# Altium schematic sheet POWR0008_BCR_System.SchDoc: BLUEsat solar battery charge regulator subystem
size A3; Engineer: Thomas Fisk; Organization: BLUEsat Project; Address1: Room 419; Address2: School of EE&T; Address3: UNSW, NSW 2052; Address4: Australia; DocumentNumber: POWR0008; SheetNumber: 1; SheetTotal: 1; Description: Solar battery charge regulator subsystem.; Version: 2.6; PageSetup: Record=PageOptions|CenterHorizontal=True|CenterVertical=True|PrintScale=0.71|XCorrection=1.00|YCorrection=1.00|PrintKind=1|BorderSize=5000000|LeftOffset=0|BottomOffset=0|Orientation=2|PaperLength=2970|PaperWidth=2100|Scale=100|PaperSource=7|PrintQuality=1200|MediaType=1|DitherType=10|PaperKind=A4|PrintScaleMode=1
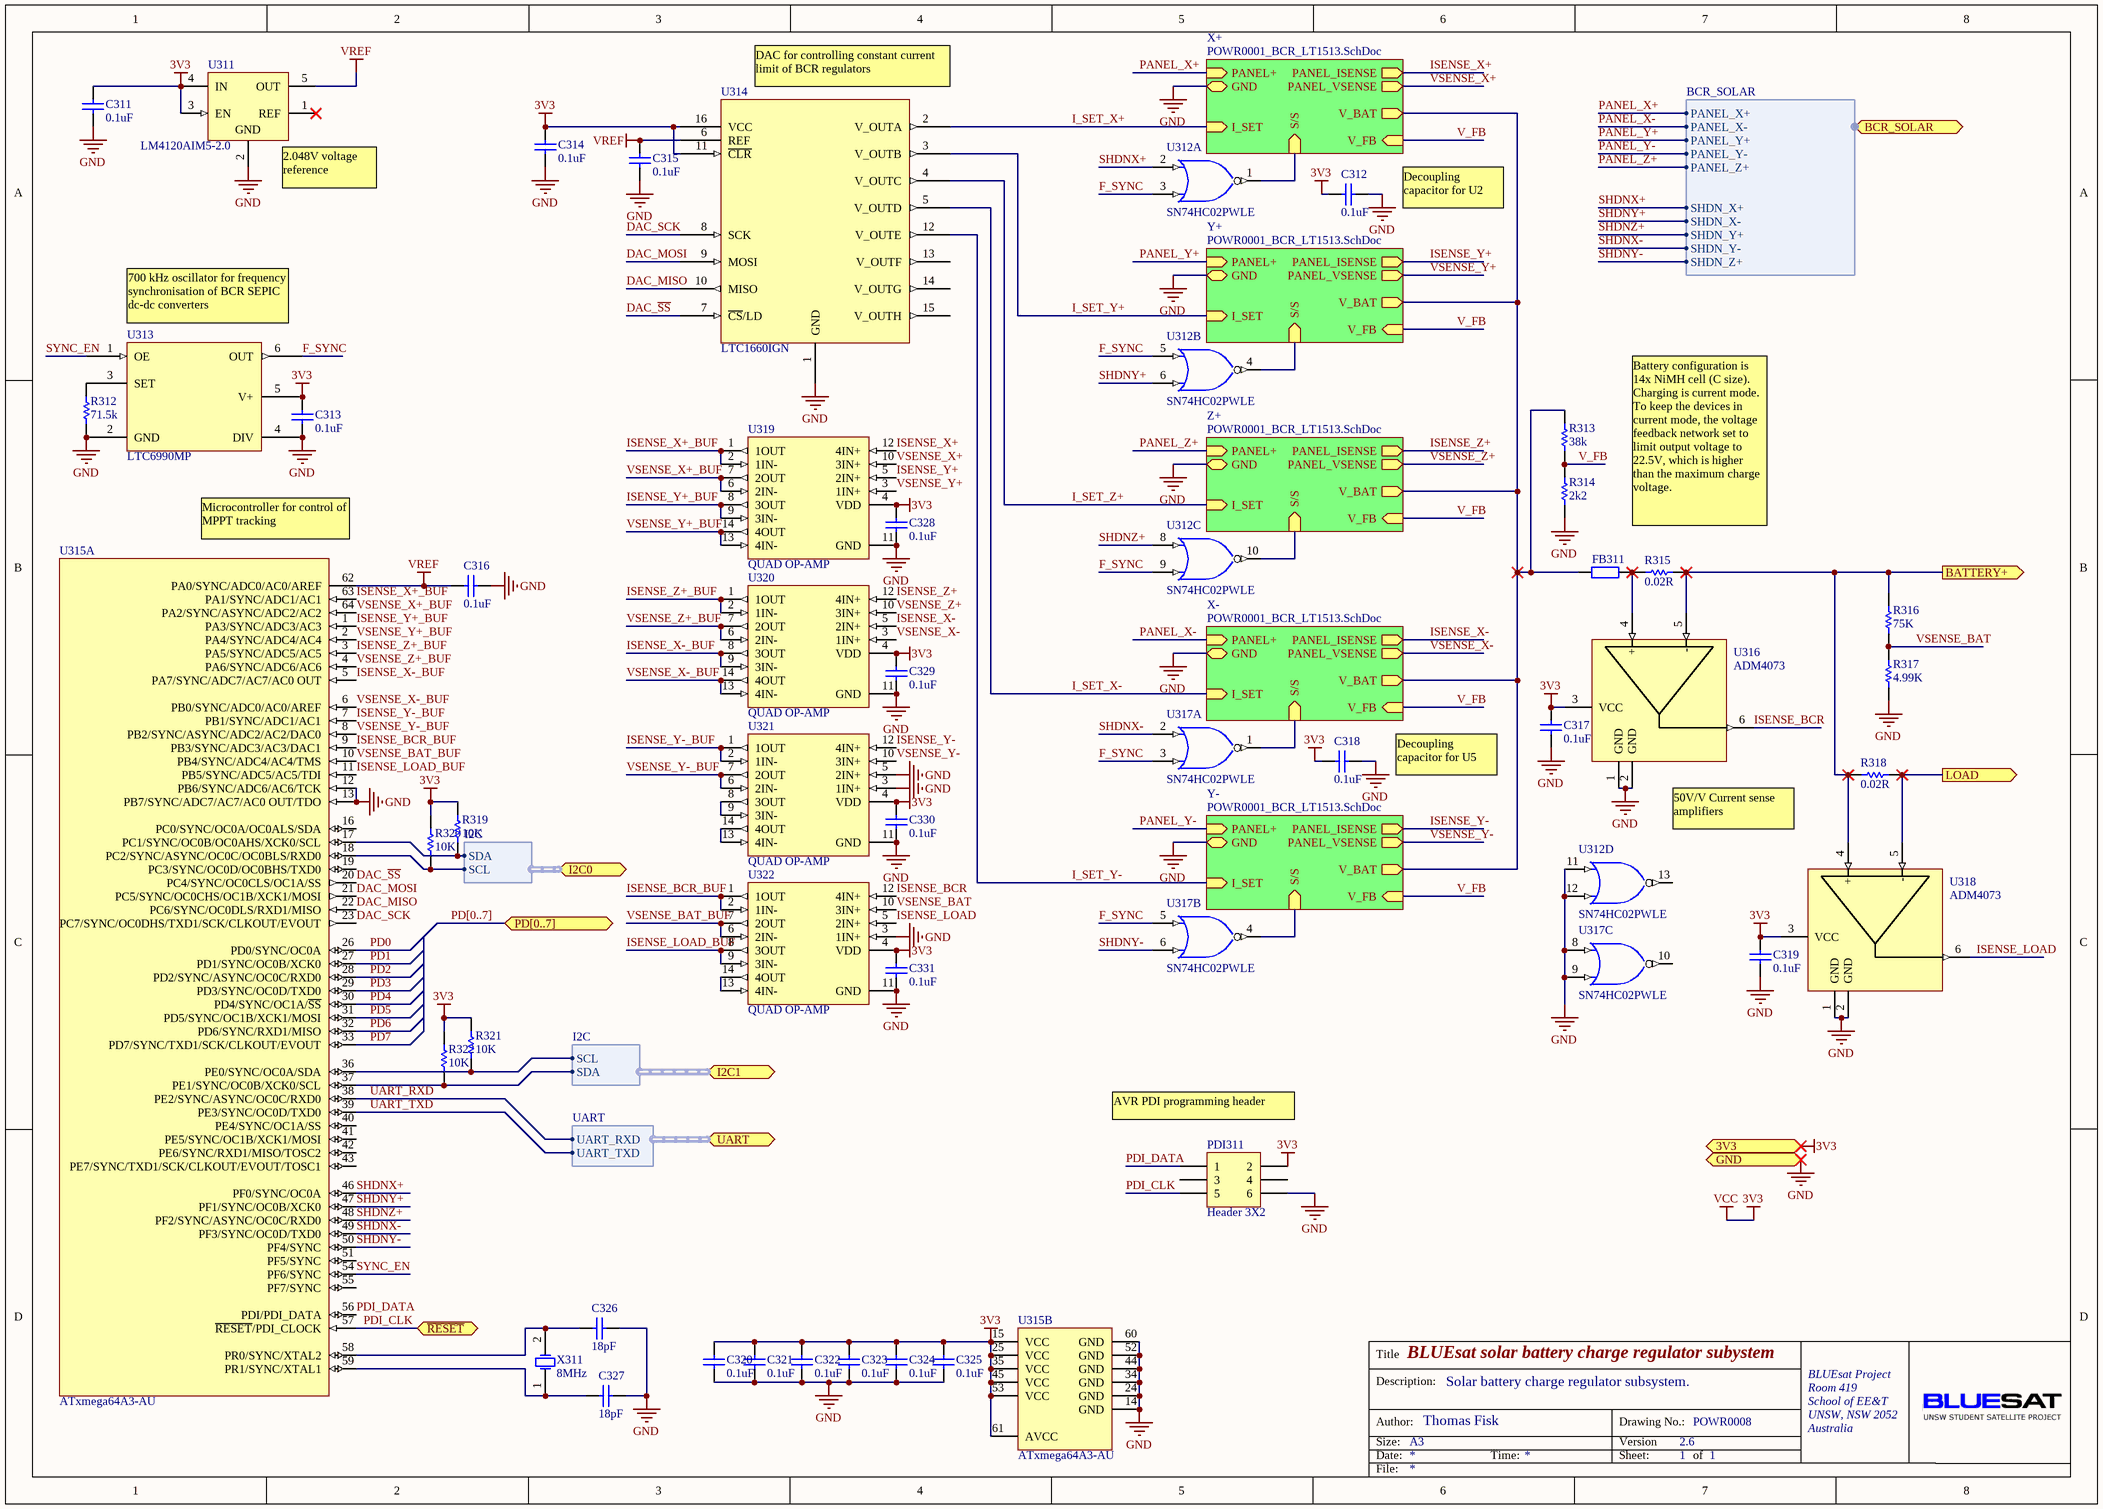
[diagram p0: POWR0008_BCR_System.SchDoc]

## Parts
C311  value 0.1uF  [CAPC2012M]  (hidden comment: Cap)
C312  value 0.1uF  [CAPC2012M]  (hidden comment: Cap)
C313  value 0.1uF  [CAPC2012M]  (hidden comment: Cap)
C314  value 0.1uF  [CAPC2012M]  (hidden comment: Cap)
C315  value 0.1uF  [CAPC2012M]  (hidden comment: Cap)
C316  value 0.1uF  [CAPC2012M]  (hidden comment: Cap)
C317  value 0.1uF  [CAPC2012M]  (hidden comment: Cap)
C318  value 0.1uF  [CAPC2012M]  (hidden comment: Cap)
C319  value 0.1uF  [CAPC2012M]  (hidden comment: Cap)
C320  value 0.1uF  [CAPC2012M]  (hidden comment: Cap)
C321  value 0.1uF  [CAPC2012M]  (hidden comment: Cap)
C322  value 0.1uF  [CAPC2012M]  (hidden comment: Cap)
C323  value 0.1uF  [CAPC2012M]  (hidden comment: Cap)
C324  value 0.1uF  [CAPC2012M]  (hidden comment: Cap)
C325  value 0.1uF  [CAPC2012M]  (hidden comment: Cap)
C326  value 18pF  [CAPC2012M]  (hidden comment: Cap)
C327  value 18pF  [CAPC2012M]  (hidden comment: Cap)
C328  value 0.1uF  [CAPC2012M]  (hidden comment: Cap)
C329  value 0.1uF  [CAPC2012M]  (hidden comment: Cap)
C330  value 0.1uF  [CAPC2012M]  (hidden comment: Cap)
C331  value 0.1uF  [CAPC2012M]  (hidden comment: Cap)
FB311  Res2  [RESC2012M]  (value not drawn)
PDI311  Header 3X2  [HDR2X3]
R312  value 71.5k  [RESC2012M]  (hidden comment: Res1)
R313  value 38k  [RESC2012M]  (hidden comment: Res1)
R314  value 2k2  [RESC2012M]  (hidden comment: Res1)
R315  value 0.02R  [RESC2012M]  (hidden comment: 0805 Resistor)
R316  value 75K  [RESC2012M]  (hidden comment: Res1)
R317  value 4.99K  [RESC2012M]  (hidden comment: Res1)
R318  value 0.02R  [RESC2012M]  (hidden comment: 0805 Resistor)
R319  value 10K  [RESC2012M]  (hidden comment: Res1)
R320  value 10K  [RESC2012M]  (hidden comment: Res1)
R321  value 10K  [RESC2012M]  (hidden comment: Res1)
R322  value 10K  [RESC2012M]  (hidden comment: Res1)
U311  LM4120AIM5-2.0  [MF05A_N]
U312  SN74HC02PWLE  [TSOP65P640-14AN]  (parts A,B,C,D of 4)
U313  LTC6990MP  [SOT26A-6L]
U314  LTC1660IGN  [SOP635P600-16N]
U315  ATxmega64A3-AU  [64A_N]  (parts A,B of 2)
U316  ADM4073  [SOT26A-6N]
U317  SN74HC02PWLE  [TSOP65P640-14AN]  (parts A,B,C of 4)
U318  ADM4073  [SOT26A-6N]
U319  QUAD OP-AMP  [TSOP65P640-14AN]
U320  QUAD OP-AMP  [TSOP65P640-14AN]
U321  QUAD OP-AMP  [TSOP65P640-14AN]
U322  QUAD OP-AMP  [TSOP65P640-14AN]
X311  8MHz  [HC49 - No border]

## Sub-sheets
X+ = POWR0001_BCR_LT1513.SchDoc: I_SET (in), V_BAT, S/S (in), V_FB (in), PANEL_VSENSE (out), PANEL_ISENSE (out), PANEL+ (in), GND
X- = POWR0001_BCR_LT1513.SchDoc: I_SET (in), V_BAT, S/S (in), V_FB (in), PANEL_VSENSE (out), PANEL_ISENSE (out), PANEL+ (in), GND
Y+ = POWR0001_BCR_LT1513.SchDoc: I_SET (in), V_BAT, S/S (in), V_FB (in), PANEL_VSENSE (out), PANEL_ISENSE (out), PANEL+ (in), GND
Y- = POWR0001_BCR_LT1513.SchDoc: I_SET (in), V_BAT, S/S (in), V_FB (in), PANEL_VSENSE (out), PANEL_ISENSE (out), PANEL+ (in), GND
Z+ = POWR0001_BCR_LT1513.SchDoc: I_SET (in), V_BAT, S/S (in), V_FB (in), PANEL_VSENSE (out), PANEL_ISENSE (out), PANEL+ (in), GND

## Ports
3V3, BATTERY+ (out), BCR_SOLAR (harness BCR_SOLAR), GND, I2C0 (harness I2C), I2C1 (harness I2C), LOAD (out), PD[0..7] (bidir), UART (harness UART), ~{RESET} (bidir)

## Harnesses
BCR_SOLAR: PANEL_X+, PANEL_X-, PANEL_Y+, PANEL_Y-, PANEL_Z+, SHDN_X+, SHDN_X-, SHDN_Y+, SHDN_Y-, SHDN_Z+
I2C: SCL, SDA
UART: UART_TXD, UART_RXD

## Nets
3V3: C311.2 C312.2 C313.1 C314.2 C317.1 C318.2 C319.1 C320.2 C321.2 C322.2 C323.2 C324.2 C325.2 C328.1 C329.1 C330.1 C331.1 PDI311.2 R319.1 R320.1 R321.1 R322.1 U311.3(EN) U311.4(IN) U312.14(VCC) U313.5(V+) U314.11(~{CLR}) U314.16(VCC) U315.15(VCC) U315.25(VCC) U315.35(VCC) U315.45(VCC) U315.53(VCC) U315.61(AVCC) U316.3(VCC) U317.14(VCC) U318.3(VCC) U319.4(VDD) U320.4(VDD) U321.4(VDD) U322.4(VDD) ; port 3V3  [also labelled VCC]
GND: C311.1 C312.1 C313.2 C314.1 C315.1 C316.1 C317.2 C318.1 C319.2 C320.1 C321.1 C322.1 C323.1 C324.1 C325.1 C326.2 C327.1 C328.2 C329.2 C330.2 C331.2 PDI311.6 R312.1 R314.1 R317.2 U311.2(GND) U312.7(GND) U312.11(A) U312.12(B) U313.2(GND) U313.4(DIV) U314.1(GND) U315.12(PB6/SYNC/ADC6/AC6/TCK) U315.13(PB7/SYNC/ADC7/AC7/AC0_OUT/TDO) U315.14(GND) U315.24(GND) U315.34(GND) U315.44(GND) U315.52(GND) U315.60(GND) U316.1(GND) U316.2(GND) U317.7(GND) U317.8(A) U317.9(B) U318.1(GND) U318.2(GND) U319.11(GND) U320.11(GND) U321.3(1IN+) U321.5(2IN+) U321.11(GND) U322.3(1IN+) U322.11(GND) ; port GND, sheet X+/GND, sheet Y+/GND, sheet Z+/GND, sheet X-/GND, sheet Y-/GND
VREF: C315.2 C316.2 U311.5(OUT) U314.6(REF) U315.62(PA0/SYNC/ADC0/AC0/AREF)
BATTERY+: R315.2 R316.1 R318.2 U316.5(-) U318.4(+) ; port BATTERY+
DAC_MISO: U314.10(MISO) U315.22(PC6/SYNC/OC0DLS/RXD1/MISO)
DAC_MOSI: U314.9(MOSI) U315.21(PC5/SYNC/OC0CHS/OC1B/XCK1/MOSI)
DAC_~{SS}: U314.7(~{CS}/LD) U315.20(PC4/SYNC/OC0CLS/OC1A/SS)
DAC_SCK: U314.8(SCK) U315.23(PC7/SYNC/OC0DHS/TXD1/SCK/CLKOUT/EVOUT)
F_SYNC: U312.3(B) U312.5(A) U312.9(B) U313.6(OUT) U317.3(B) U317.5(A)
I_SET_X+: U314.2(V_OUTA) ; sheet X+/I_SET
I_SET_X-: U314.5(V_OUTD) ; sheet X-/I_SET
I_SET_Y+: U314.3(V_OUTB) ; sheet Y+/I_SET
I_SET_Y-: U314.12(V_OUTE) ; sheet Y-/I_SET
I_SET_Z+: U314.4(V_OUTC) ; sheet Z+/I_SET
ISENSE_BCR: U316.6 U322.12(4IN+)
ISENSE_BCR_BUF: U315.9(PB3/SYNC/ADC3/AC3/DAC1) U322.1(1OUT) U322.2(1IN-)
ISENSE_LOAD: U318.6 U322.5(2IN+)
ISENSE_LOAD_BUF: U315.11(PB5/SYNC/ADC5/AC5/TDI) U322.8(3OUT) U322.9(3IN-)
ISENSE_X+: U319.12(4IN+) ; sheet X+/PANEL_ISENSE
ISENSE_X+_BUF: U315.63(PA1/SYNC/ADC1/AC1) U319.1(1OUT) U319.2(1IN-)
ISENSE_X-: U320.5(2IN+) ; sheet X-/PANEL_ISENSE
ISENSE_X-_BUF: U315.5(PA7/SYNC/ADC7/AC7/AC0_OUT) U320.8(3OUT) U320.9(3IN-)
ISENSE_Y+: U319.5(2IN+) ; sheet Y+/PANEL_ISENSE
ISENSE_Y+_BUF: U315.1(PA3/SYNC/ADC3/AC3) U319.8(3OUT) U319.9(3IN-)
ISENSE_Y-: U321.12(4IN+) ; sheet Y-/PANEL_ISENSE
ISENSE_Y-_BUF: U315.7(PB1/SYNC/ADC1/AC1) U321.1(1OUT) U321.2(1IN-)
ISENSE_Z+: U320.12(4IN+) ; sheet Z+/PANEL_ISENSE
ISENSE_Z+_BUF: U315.3(PA5/SYNC/ADC5/AC5) U320.1(1OUT) U320.2(1IN-)
LOAD: R318.1 U318.5(-) ; port LOAD
PANEL_X+: sheet X+/PANEL+, port BCR_SOLAR.PANEL_X+
PANEL_X-: sheet X-/PANEL+, port BCR_SOLAR.PANEL_X-
PANEL_Y+: sheet Y+/PANEL+, port BCR_SOLAR.PANEL_Y+
PANEL_Y-: sheet Y-/PANEL+, port BCR_SOLAR.PANEL_Y-
PANEL_Z+: sheet Z+/PANEL+, port BCR_SOLAR.PANEL_Z+
PD0: U315.26(PD0/SYNC/OC0A)
PD1: U315.27(PD1/SYNC/OC0B/XCK0)
PD2: U315.28(PD2/SYNC/ASYNC/OC0C/RXD0)
PD3: U315.29(PD3/SYNC/OC0D/TXD0)
PD4: U315.30(PD4/SYNC/OC1A/~{SS})
PD5: U315.31(PD5/SYNC/OC1B/XCK1/MOSI)
PD6: U315.32(PD6/SYNC/RXD1/MISO)
PD7: U315.33(PD7/SYNC/TXD1/SCK/CLKOUT/EVOUT)
PDI_CLK: PDI311.5 U315.57(~{RESET}/PDI_CLOCK) ; port ~{RESET}
PDI_DATA: PDI311.1 U315.56(PDI/PDI_DATA)
SHDNX+: U312.2(A) U315.46(PF0/SYNC/OC0A) ; port BCR_SOLAR.SHDN_X+
SHDNX-: U315.49(PF3/SYNC/OC0D/TXD0) U317.2(A) ; port BCR_SOLAR.SHDN_Y-
SHDNY+: U312.6(B) U315.47(PF1/SYNC/OC0B/XCK0) ; port BCR_SOLAR.SHDN_X-
SHDNY-: U315.50(PF4/SYNC) U317.6(B) ; port BCR_SOLAR.SHDN_Z+
SHDNZ+: U312.8(A) U315.48(PF2/SYNC/ASYNC/OC0C/RXD0) ; port BCR_SOLAR.SHDN_Y+
SYNC_EN: U313.1(OE) U315.54(PF6/SYNC)
UART_RXD: U315.38(PE2/SYNC/ASYNC/OC0C/RXD0) ; port UART.UART_RXD
UART_TXD: U315.39(PE3/SYNC/OC0D/TXD0) ; port UART.UART_TXD
V_FB: R313.1 R314.2 ; sheet X+/V_FB, sheet Y+/V_FB, sheet Z+/V_FB, sheet X-/V_FB, sheet Y-/V_FB
VSENSE_BAT: R316.2 R317.1 U322.10(3IN+)
VSENSE_BAT_BUF: U315.10(PB4/SYNC/ADC4/AC4/TMS) U322.6(2IN-) U322.7(2OUT)
VSENSE_X+: U319.10(3IN+) ; sheet X+/PANEL_VSENSE
VSENSE_X+_BUF: U315.64(PA2/SYNC/ASYNC/ADC2/AC2) U319.6(2IN-) U319.7(2OUT)
VSENSE_X-: U320.3(1IN+) ; sheet X-/PANEL_VSENSE
VSENSE_X-_BUF: U315.6(PB0/SYNC/ADC0/AC0/AREF) U320.13(4IN-) U320.14(4OUT)
VSENSE_Y+: U319.3(1IN+) ; sheet Y+/PANEL_VSENSE
VSENSE_Y+_BUF: U315.2(PA4/SYNC/ADC4/AC4) U319.13(4IN-) U319.14(4OUT)
VSENSE_Y-: U321.10(3IN+) ; sheet Y-/PANEL_VSENSE
VSENSE_Y-_BUF: U315.8(PB2/SYNC/ASYNC/ADC2/AC2/DAC0) U321.6(2IN-) U321.7(2OUT)
VSENSE_Z+: U320.10(3IN+) ; sheet Z+/PANEL_VSENSE
VSENSE_Z+_BUF: U315.4(PA6/SYNC/ADC6/AC6) U320.6(2IN-) U320.7(2OUT)
NetC326_1: C326.1 U315.58(PR0/SYNC/XTAL2) X311.2(OSC2)
NetC327_2: C327.2 U315.59(PR1/SYNC/XTAL1) X311.1(OSC1)
NetFB311_1: FB311.1 R313.2 ; sheet X+/V_BAT, sheet Y+/V_BAT, sheet Z+/V_BAT, sheet X-/V_BAT, sheet Y-/V_BAT
NetFB311_2: FB311.2 R315.1 U316.4(+)
NetR312_2: R312.2 U313.3(SET)
NetR319_2: R319.2 U315.17(PC1/SYNC/OC0B/OC0AHS/XCK0/SCL) ; port I2C0.SDA
NetR320_2: R320.2 U315.18(PC2/SYNC/ASYNC/OC0C/OC0BLS/RXD0) ; port I2C0.SCL
NetR321_2: R321.2 U315.36(PE0/SYNC/OC0A/SDA) ; port I2C1.SCL
NetR322_2: R322.2 U315.37(PE1/SYNC/OC0B/XCK0/SCL) ; port I2C1.SDA
NetU312_1: U312.1(Y) ; sheet X+/S/S
NetU312_4: U312.4(Y) ; sheet Y+/S/S
NetU312_10: U312.10(Y) ; sheet Z+/S/S
NetU317_1: U317.1(Y) ; sheet X-/S/S
NetU317_4: U317.4(Y) ; sheet Y-/S/S
NetU321_8: U321.8(3OUT) U321.9(3IN-)
NetU321_13: U321.13(4IN-) U321.14(4OUT)
NetU322_13: U322.13(4IN-) U322.14(4OUT)

Not connected (* = marked no-connect by the designer): PDI311 3 4; U311 1(REF)*; U312 13(Y); U314 13(V_OUTF) 14(V_OUTG) 15(V_OUTH); U315 16(PC0/SYNC/OC0A/OC0ALS/SDA) 19(PC3/SYNC/OC0D/OC0BHS/TXD0) 40(PE4/SYNC/OC1A/SS) 41(PE5/SYNC/OC1B/XCK1/MOSI) 42(PE6/SYNC/RXD1/MISO/TOSC2) 43(PE7/SYNC/TXD1/SCK/CLKOUT/EVOUT/TOSC1) 51(PF5/SYNC) 55(PF7/SYNC); U317 10(Y)

## Buses and harness runs
bus PD[0..7] = port PD[0..7]

## Notes on the sheet
- (near U314) DAC for controlling constant current limit of BCR regulators
- (near U311) 2.048V voltage reference
- (near C312) Decoupling capacitor for U2
- (near U313) 700 kHz oscillator for frequency synchronisation of BCR SEPIC dc-dc converters
- Microcontroller for control of MPPT tracking
- Battery configuration is 14x NiMH cell (C size). Charging is current mode. To keep the devices in current mode, the voltage feedback network set to limit output voltage to 22.5V, which is higher than the maximum charge voltage.
- Decoupling capacitor for U5
- 50V/V Current sense amplifiers
- (near PDI311) AVR PDI programming header
- Title
- Description:
- Size:
- Author:
- Date:
- A3
- Time:
- Version
- Sheet:
- Drawing No.:
- of
- File:

## Library data of the parts
C311-C331 = Cap: Capacitor; Published: 8-Jun-2000; LatestRevisionDate: 17-Jul-2002; LatestRevisionNote: Re-released for DXP Platform.; PackageReference: RAD-0.3; Publisher: Altium Limited; PackageDescription: Radial Cap, Thru-Hole; 2 Leads; 0.3 in Pin Spacing; Supplier 1: Farnell; Supplier 2: Farnell; Supplier Part Number 2: 1759265
FB311 = Res2: Resistor; Value: 1K; Published: 8-Jun-2000; LatestRevisionDate: 17-Jul-2002; LatestRevisionNote: Re-released for DXP Platform.; PackageReference: AXIAL-0.4; Publisher: Altium Limited; PackageDescription: Axial Device, Thru-Hole; 2 Leads; 0.4 in Pin Spacing
PDI311 = Header 3X2: Header, 3-Pin, Dual row; LatestRevisionDate: 17-Jul-2002; LatestRevisionNote: Re-released for DXP Platform.; Publisher: Altium Limited
R312-R322 = Res1: Resistor; Published: 8-Jun-2000; LatestRevisionDate: 17-Jul-2002; LatestRevisionNote: Re-released for DXP Platform.; PackageReference: AXIAL-0.3; Publisher: Altium Limited; PackageDescription: Axial Device, Thru-Hole; 2 Leads; 0.3 in Pin Spacing; Supplier 1: Farnell
U311 = LM4120AIM5-2.0: Precision Micropower Low Dropout Voltage Reference; Manufacturer: National Semiconductor; CompType: Voltage Reference IC; PackageTopMarking: R14A*XTT; PowerWise: Y; Published: 4-Dec-2008; DatasheetVersion: Mar-2005; PackageVersion: revD, Aug-2008; PackageReference: MF05A; Publisher: Altium Limited; PackageDescription: Molded SOT-23, .115 x .063 x .040 in Body, 5 Lead, .0375 in Pitch; PartNumber: LM4120AIM5-2.0; RoHS: O; PinCount: 5; DigiKeyPartNumber: LM4120AIM5-2.0CT-ND; ComponentLink1Description: LM4120 Datasheet; ComponentLink1URL: http://www.national.com/ds/LM/LM4120.pdf; ComponentLink2Description: LM4120 Web Page; ComponentLink2URL: http://www.national.com/pf/LM/LM4120.html; ComponentLink3Description: MF05A Package Page; ComponentLink3URL: http://www.national.com/packaging/folders/mf05a.html
U312 U317 = SN74HC02PWLE: Quadruple 2-Input Positive-NOR Gate; Published: 8-Jun-2000; LatestRevisionDate: 04-Mar-2005; LatestRevisionNote: Stylized 3D Model Added.; DatasheetVersion: May-1997; PackageVersion: Feb-1999; PackageReference: PW014; Publisher: Altium Limited; PackageDescription: Shrink Small Outline; 14 Leads; Body Width 4.4 mm; Pitch 0.65 mm; ComponentLink1Description: Manufacturer Link; ComponentLink1URL: http://www.ti.com/; ComponentLink2Description: Datasheet; ComponentLink2URL: http://www-s.ti.com/sc/ds/sn74hc02.pdf
U315 = ATxmega64A3-AU: 8/16-bit AVR XMEGA A3 Microcontroller, 1.6-3.6V, 32MHz, 64KB + 4KB Flash, 2KB EEPROM, 4KB SRAM, 64-pin TQFP, Industrial Grade (-40°C to 85°C), Pb-Free; DatasheetVersion: revT, Dec-2010; PackageVersion: revC, Oct-2010; PackageReference: 64A; PackageDescription: 64-Pin Plastic Thin Profile Quad Flat Pack, 14 x 14 x 1.0 mm Body, 0.8 mm Pitch (TQFP); Code_JEDEC: MS-026-AEB; ComponentLink1Description: Manufacturer URL; ComponentLink1URL: http://www.atmel.com/; ComponentLink2Description: ATxmega64A3/128A3/192A3/256A3 Datasheet; ComponentLink2URL: http://www.atmel.com/dyn/resources/prod_documents/doc8068.pdf
U316 U318 = ADM4073: Current Sense Amplifer
U319-U322 = TLC2254CPWR: IC OPAMP QUAD 14-TSSOP
X311 = XTAL: Crystal Oscillator; Published: 8-Jun-2000; LatestRevisionDate: 17-Jul-2002; LatestRevisionNote: Re-released for DXP Platform.; PackageReference: R38; Publisher: Altium Limited; PackageDescription: Crystal, Thru-Hole; 2 Leads; Body 3.1 x 8.2 mm (Dia.xH)